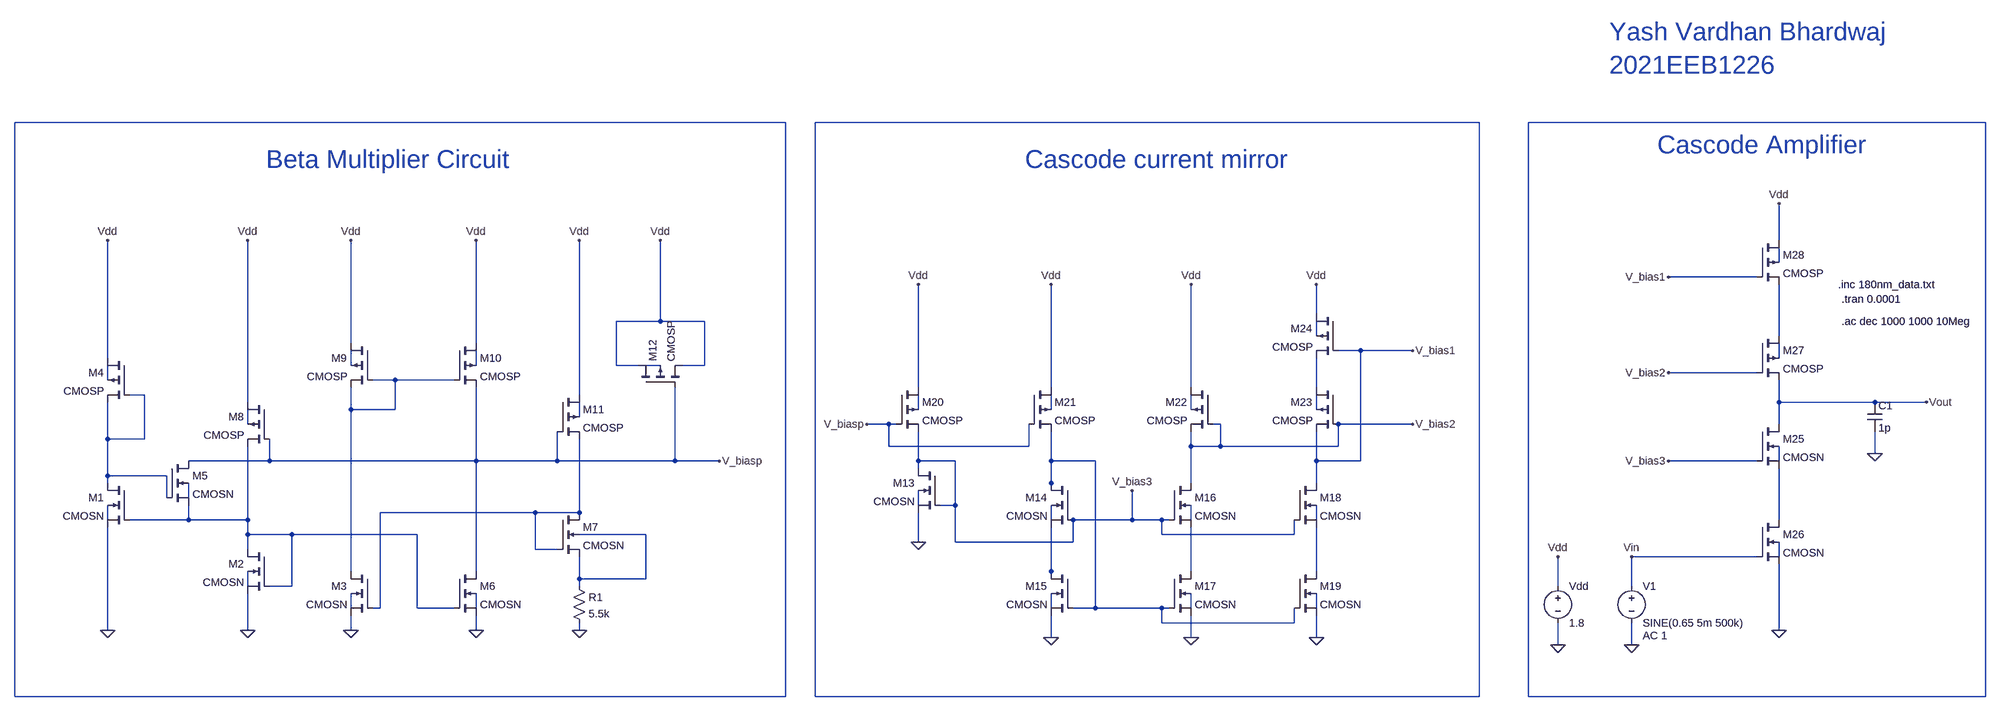
[diagram p0: schematic project_180nm.asc]
project_180nm.asc, the LTspice schematic file:
Version 4
SHEET 1 5224 708
WIRE 1744 -544 32 -544
WIRE 3296 -544 1808 -544
WIRE 4400 -544 3408 -544
WIRE 3952 -288 3952 -368
WIRE 3952 -240 3952 -272
WIRE 3904 -208 3712 -208
WIRE 2896 -128 2896 -192
WIRE 1472 -112 1472 -288
WIRE 1472 -112 1376 -112
WIRE 1568 -112 1472 -112
WIRE 2896 -80 2896 -112
WIRE 3952 -80 3952 -192
WIRE 800 -64 800 -288
WIRE 1072 -64 1072 -288
WIRE 2992 -48 2944 -48
WIRE 3152 -48 2992 -48
WIRE 272 -32 272 -288
WIRE 3952 -32 3952 -64
WIRE 800 -16 800 -48
WIRE 1072 -16 1072 -48
WIRE 1376 -16 1376 -112
WIRE 1424 -16 1376 -16
WIRE 1472 -16 1440 -16
WIRE 1568 -16 1568 -112
WIRE 1568 -16 1520 -16
WIRE 3904 0 3712 0
WIRE 272 16 272 -16
WIRE 896 16 848 16
WIRE 1024 16 896 16
WIRE 2032 32 2032 -192
WIRE 2320 32 2320 -192
WIRE 2624 32 2624 -192
WIRE 2896 32 2896 -32
WIRE 352 48 320 48
WIRE 1296 48 1296 -288
WIRE 576 64 576 -288
WIRE 3952 64 3952 16
WIRE 4160 64 3952 64
WIRE 4272 64 4160 64
WIRE 800 80 800 32
WIRE 896 80 896 16
WIRE 896 80 800 80
WIRE 2032 80 2032 48
WIRE 2320 80 2320 48
WIRE 2624 80 2624 48
WIRE 2896 80 2896 48
WIRE 1296 96 1296 64
WIRE 576 112 576 80
WIRE 1968 112 1920 112
WIRE 1984 112 1968 112
WIRE 2688 112 2672 112
WIRE 3152 112 2944 112
WIRE 3952 112 3952 64
WIRE 272 144 272 64
WIRE 352 144 352 48
WIRE 352 144 272 144
WIRE 1968 160 1968 112
WIRE 2272 160 2272 112
WIRE 2272 160 1968 160
WIRE 2624 160 2624 128
WIRE 2688 160 2688 112
WIRE 2688 160 2624 160
WIRE 2944 160 2944 112
WIRE 2944 160 2688 160
WIRE 4160 176 4160 128
WIRE 624 192 624 144
WIRE 624 192 448 192
WIRE 1072 192 1072 32
WIRE 1072 192 624 192
WIRE 1248 192 1248 128
WIRE 1248 192 1072 192
WIRE 1504 192 1504 32
WIRE 1504 192 1248 192
WIRE 1600 192 1504 192
WIRE 2032 192 2032 128
WIRE 2112 192 2032 192
WIRE 2320 192 2320 128
WIRE 2416 192 2320 192
WIRE 2896 192 2896 128
WIRE 2992 192 2992 -48
WIRE 2992 192 2896 192
WIRE 3904 192 3712 192
WIRE 3952 192 3952 160
WIRE 2032 208 2032 192
WIRE 272 224 272 144
WIRE 400 224 272 224
WIRE 272 240 272 224
WIRE 2320 240 2320 192
WIRE 2624 240 2624 160
WIRE 2896 240 2896 192
WIRE 2320 256 2320 240
WIRE 400 272 400 224
WIRE 448 272 448 240
WIRE 2032 288 2032 256
WIRE 2112 288 2112 192
WIRE 2112 288 2080 288
WIRE 1200 304 864 304
WIRE 1296 304 1296 144
WIRE 1296 304 1200 304
WIRE 272 320 272 288
WIRE 448 320 448 288
WIRE 448 320 320 320
WIRE 576 320 576 160
WIRE 576 320 448 320
WIRE 2320 320 2320 288
WIRE 2496 320 2496 256
WIRE 2496 320 2368 320
WIRE 2560 320 2496 320
WIRE 2576 320 2560 320
WIRE 2624 320 2624 288
WIRE 2896 320 2896 288
WIRE 3952 320 3952 208
WIRE 576 352 576 320
WIRE 672 352 576 352
WIRE 944 352 672 352
WIRE 1440 352 1296 352
WIRE 2560 352 2560 320
WIRE 2848 352 2848 320
WIRE 2848 352 2560 352
WIRE 2032 368 2032 304
WIRE 2112 368 2112 288
WIRE 2368 368 2368 320
WIRE 2368 368 2112 368
WIRE 576 384 576 352
WIRE 1200 384 1200 304
WIRE 1248 384 1200 384
WIRE 3904 400 3632 400
WIRE 3952 400 3952 368
WIRE 800 432 800 80
WIRE 1072 432 1072 192
WIRE 2320 432 2320 336
WIRE 2624 432 2624 336
WIRE 2896 432 2896 336
WIRE 1296 448 1296 400
WIRE 1440 448 1440 352
WIRE 1440 448 1296 448
WIRE 2320 448 2320 432
WIRE 576 464 576 432
WIRE 672 464 672 352
WIRE 672 464 624 464
WIRE 1296 464 1296 448
WIRE 3472 464 3472 400
WIRE 3632 464 3632 400
WIRE 800 512 800 480
WIRE 864 512 864 304
WIRE 864 512 848 512
WIRE 944 512 944 352
WIRE 1024 512 944 512
WIRE 1072 512 1072 480
WIRE 2320 512 2320 480
WIRE 2416 512 2416 192
WIRE 2416 512 2368 512
WIRE 2560 512 2416 512
WIRE 2576 512 2560 512
WIRE 2624 512 2624 480
WIRE 2896 512 2896 480
WIRE 2560 544 2560 512
WIRE 2848 544 2848 512
WIRE 2848 544 2560 544
WIRE 272 560 272 336
WIRE 576 560 576 480
WIRE 800 560 800 528
WIRE 1072 560 1072 528
WIRE 1296 560 1296 544
WIRE 3952 560 3952 416
WIRE 2320 576 2320 528
WIRE 2624 576 2624 528
WIRE 2896 576 2896 528
WIRE 3472 592 3472 544
WIRE 3632 592 3632 544
WIRE 32 704 32 -544
WIRE 1744 704 1744 -544
WIRE 1744 704 32 704
WIRE 1808 704 1808 -544
WIRE 3296 704 3296 -544
WIRE 3296 704 1808 704
WIRE 3408 704 3408 -544
WIRE 4400 704 4400 -544
WIRE 4400 704 3408 704
FLAG 1600 192 V_biasp
FLAG 1472 -288 Vdd
FLAG 1296 -288 Vdd
FLAG 1072 -288 Vdd
FLAG 800 -288 Vdd
FLAG 576 -288 Vdd
FLAG 272 -288 Vdd
FLAG 272 560 0
FLAG 576 560 0
FLAG 800 560 0
FLAG 1072 560 0
FLAG 3472 592 0
FLAG 3472 400 Vdd
FLAG 1296 560 0
FLAG 2896 576 0
FLAG 2624 576 0
FLAG 2320 576 0
FLAG 2032 368 0
FLAG 3152 -48 V_bias1
FLAG 3152 112 V_bias2
FLAG 2496 256 V_bias3
FLAG 2032 -192 Vdd
FLAG 2320 -192 Vdd
FLAG 2624 -192 Vdd
FLAG 2896 -192 Vdd
FLAG 1920 112 V_biasp
FLAG 3632 592 0
FLAG 3952 560 0
FLAG 4160 176 0
FLAG 3712 -208 V_bias1
FLAG 3712 0 V_bias2
FLAG 3712 192 V_bias3
FLAG 3952 -368 Vdd
FLAG 4272 64 Vout
FLAG 3632 400 Vin
SYMBOL nmos4 320 240 M0
SYMATTR InstName M1
SYMATTR Value CMOSN
SYMATTR Value2 l=180n w=900n
SYMBOL nmos4 624 384 M0
SYMATTR InstName M2
SYMATTR Value CMOSN
SYMATTR Value2 l=180n w=900n
SYMBOL nmos4 848 432 M0
SYMATTR InstName M3
SYMATTR Value CMOSN
SYMATTR Value2 l=180n w=900n
SYMBOL nmos4 400 192 R0
SYMATTR InstName M5
SYMATTR Value CMOSN
SYMATTR Value2 l=180n w=360n
SYMBOL nmos4 1024 432 R0
SYMATTR InstName M6
SYMATTR Value CMOSN
SYMATTR Value2 l=180n w=900n
SYMBOL pmos4 320 -32 M0
SYMATTR InstName M4
SYMATTR Value CMOSP
SYMATTR Value2 l=180n w=360n
SYMBOL pmos4 624 64 M0
SYMATTR InstName M8
SYMATTR Value CMOSP
SYMATTR Value2 l=180n w=2160n
SYMBOL pmos4 848 -64 M0
SYMATTR InstName M9
SYMATTR Value CMOSP
SYMATTR Value2 l=180n w=2160n
SYMBOL pmos4 1024 -64 R0
SYMATTR InstName M10
SYMATTR Value CMOSP
SYMATTR Value2 l=180n w=2160n
SYMBOL pmos4 1248 48 R0
SYMATTR InstName M11
SYMATTR Value CMOSP
SYMATTR Value2 l=180n w=2160n
SYMBOL pmos4 1424 32 R270
SYMATTR InstName M12
SYMATTR Value CMOSP
SYMATTR Value2 l=180n w=180n
SYMBOL voltage 3472 448 R0
WINDOW 123 0 0 Left 0
WINDOW 39 0 0 Left 0
SYMATTR InstName Vdd
SYMATTR Value 1.8
SYMBOL res 1280 448 R0
SYMATTR InstName R1
SYMATTR Value 5.5k
SYMBOL nmos4 1248 304 R0
SYMATTR InstName M7
SYMATTR Value CMOSN
SYMBOL nmos4 2080 208 M0
SYMATTR InstName M13
SYMATTR Value CMOSN
SYMATTR Value2 l=360n w=360n
SYMBOL nmos4 2368 240 M0
SYMATTR InstName M14
SYMATTR Value CMOSN
SYMATTR Value2 l=180n w=360n
SYMBOL nmos4 2368 432 M0
SYMATTR InstName M15
SYMATTR Value CMOSN
SYMATTR Value2 l=180n w=425n
SYMBOL nmos4 2576 240 R0
SYMATTR InstName M16
SYMATTR Value CMOSN
SYMATTR Value2 l=180n w=9000n
SYMBOL nmos4 2576 432 R0
SYMATTR InstName M17
SYMATTR Value CMOSN
SYMATTR Value2 l=360n w=1800n
SYMBOL nmos4 2848 240 R0
SYMATTR InstName M18
SYMATTR Value CMOSN
SYMATTR Value2 l=180n w=2800n
SYMBOL nmos4 2848 432 R0
SYMATTR InstName M19
SYMATTR Value CMOSN
SYMATTR Value2 l=180n w=2800n
SYMBOL pmos4 1984 32 R0
SYMATTR InstName M20
SYMATTR Value CMOSP
SYMATTR Value2 l=180n w=13650n
SYMBOL pmos4 2272 32 R0
SYMATTR InstName M21
SYMATTR Value CMOSP
SYMATTR Value2 l=180n w=6000n
SYMBOL pmos4 2672 32 M0
SYMATTR InstName M22
SYMATTR Value CMOSP
SYMATTR Value2 l=360n w=555n
SYMBOL pmos4 2944 32 M0
SYMATTR InstName M23
SYMATTR Value CMOSP
SYMATTR Value2 l=180n w=3600n
SYMBOL pmos4 2944 -128 M0
SYMATTR InstName M24
SYMATTR Value CMOSP
SYMATTR Value2 l=180n w=1100n
SYMBOL nmos4 3904 112 R0
SYMATTR InstName M25
SYMATTR Value CMOSN
SYMATTR Value2 l=180n w=1060n
SYMBOL nmos4 3904 320 R0
SYMATTR InstName M26
SYMATTR Value CMOSN
SYMATTR Value2 l=180n w=1110n
SYMBOL pmos4 3904 -80 R0
SYMATTR InstName M27
SYMATTR Value CMOSP
SYMATTR Value2 l=180n w=1490n
SYMBOL pmos4 3904 -288 R0
SYMATTR InstName M28
SYMATTR Value CMOSP
SYMATTR Value2 l=180n w=1595n
SYMBOL cap 4144 64 R0
SYMATTR InstName C1
SYMATTR Value 1p
SYMBOL voltage 3632 448 R0
WINDOW 123 24 124 Left 2
WINDOW 39 0 0 Left 0
SYMATTR Value2 AC 1
SYMATTR InstName V1
SYMATTR Value SINE(0.65 5m 500k)
TEXT 4088 -160 Left 2 !.tran 0.0001
TEXT 4080 -192 Left 2 !.inc 180nm_data.txt
TEXT 4088 -112 Left 2 !.ac dec 1000 1000 10Meg
TEXT 3584 -752 Left 5 ;Yash Vardhan Bhardwaj \n2021EEB1226
TEXT 616 -464 Left 5 ;Beta Multiplier Circuit
TEXT 2264 -464 Left 5 ;Cascode current mirror
TEXT 3688 -496 Left 5 ;Cascode Amplifier

The netlist it stands for:
* project_180nm.asc
M1 N014 N027 0 N026 CMOSN l=180n w=900n
M2 N027 N027 0 N037 CMOSN l=180n w=900n
M3 N012 N025 0 N038 CMOSN l=180n w=900n
M5 V_biasp N014 N027 N023 CMOSN l=180n w=360n
M6 V_biasp N027 0 N039 CMOSN l=180n w=900n
M4 Vdd N014 N014 N011 CMOSP l=180n w=360n
M8 Vdd V_biasp N027 N020 CMOSP l=180n w=2160n
M9 Vdd N012 N012 N008 CMOSP l=180n w=2160n
M10 Vdd N012 V_biasp N009 CMOSP l=180n w=2160n
M11 Vdd V_biasp N025 N019 CMOSP l=180n w=2160n
M12 Vdd V_biasp Vdd N010 CMOSP l=180n w=180n
Vdd Vdd 0 1.8
R1 N032 0 5.5k
M7 N025 N025 N032 N032 CMOSN
M13 V_bias3 V_bias3 0 N024 CMOSN l=360n w=360n
M14 N021 V_bias3 N034 N028 CMOSN l=180n w=360n
M15 N034 N021 0 N040 CMOSN l=180n w=425n
M16 V_bias2 V_bias3 N035 N029 CMOSN l=180n w=9000n
M17 N035 N021 0 N041 CMOSN l=360n w=1800n
M18 V_bias1 V_bias3 N036 N030 CMOSN l=180n w=2800n
M19 N036 N021 0 N042 CMOSN l=180n w=2800n
M20 Vdd V_biasp V_bias3 N015 CMOSP l=180n w=13650n
M21 Vdd V_biasp N021 N016 CMOSP l=180n w=6000n
M22 Vdd V_bias2 V_bias2 N017 CMOSP l=360n w=555n
M23 N013 V_bias2 V_bias1 N018 CMOSP l=180n w=3600n
M24 Vdd V_bias1 N013 N005 CMOSP l=180n w=1100n
M25 Vout V_bias3 N031 N022 CMOSN l=180n w=1060n
M26 N031 Vin 0 N033 CMOSN l=180n w=1110n
M27 N006 V_bias2 Vout N007 CMOSP l=180n w=1490n
M28 Vdd V_bias1 N006 N004 CMOSP l=180n w=1595n
C1 Vout 0 1p
V1 Vin 0 SINE(0.65 5m 500k) AC 1
.model NMOS NMOS
.model PMOS PMOS
.lib standard.mos
.tran 0.0001
.inc 180nm_data.txt
.ac dec 1000 1000 10Meg
* Yash Vardhan Bhardwaj
* 2021EEB1226
* Beta Multiplier Circuit
* Cascode current mirror
* Cascode Amplifier
.backanno
.end